# EAGLE schematic brain (EAGLE 7.2.0)
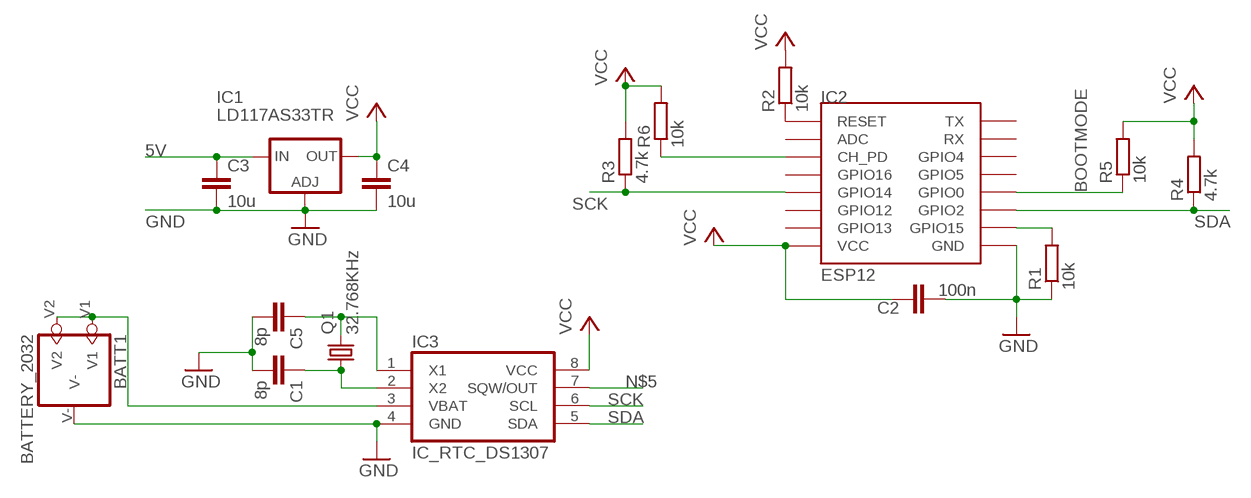
[diagram p0: schematic, sheet 1]

## Parts
BATT1  BATTERY_2032  [BATT2032]
C1  8p  C-EUC0805  [C0805]
C2  100n  C-EUC0805  [C0805]
C3  10u  C-EUC0805  [C0805]
C4  10u  C-EUC0805  [C0805]
C5  8p  C-EUC0805  [C0805]
IC1  LD117AS33TR  [SOT223]
IC2  ESP12  [ESP12]
IC3  IC_RTC_DS1307  [SO-8]
Q1  32.768KHz  CRYSTALTC26H  [TC26H]
R1  10k  R-EU_R0805  [R0805]
R2  10k  R-EU_R0805  [R0805]
R3  4.7k  R-EU_R0805  [R0805]
R4  4.7k  R-EU_R0805  [R0805]
R5  10k  R-EU_R0805  [R0805]
R6  10k  R-EU_R0805  [R0805]

## Nets
5V: C3.1 IC1.3(IN)
BOOTMODE: IC2.GPIO0 R5.1
GND: BATT1.V- C1.2 C2.2 C3.2 C4.2 C5.2 IC1.1(ADJ) IC2.GND IC3.4(GND) R1.1
N$1: IC2.RESET R2.1
N$2: IC2.GPIO15 R1.2
N$4: IC2.CH_PD R6.1
N$5: IC3.7(SQW/OUT)
N$6: C5.1 IC3.1(X1) Q1.2
N$7: BATT1.V1 BATT1.V2 IC3.3(VBAT)
N$8: C1.1 IC3.2(X2) Q1.1
SCK: IC2.GPIO14 IC3.6(SCL) R3.1
SDA: IC2.GPIO2 IC3.5(SDA) R4.1
VCC: C2.1 C4.1 IC1.4(OUT) IC2.VCC IC3.8(VCC) R2.2 R3.2 R4.2 R5.2 R6.2
Unconnected: IC2.ADC IC2.GPIO4 IC2.GPIO5 IC2.GPIO12 IC2.GPIO13 IC2.GPIO16 IC2.RX IC2.TX

## Library data of the parts
BATT1 = dp_devices:BATTERY_2032: BATTERY
C1-C5 = rcl:C-EU: CAPACITOR, European symbol
IC1 = v-reg:LD117A?*: Low drop fixed and adjustable positive voltage regulators 1 A Source: http://www.st.com/stonline/products/literature/ds/7194/ld1117axx.pdf
IC2 = esp8266modules:ESP12: ESP8266 Wifi module 12
IC3 = dp_devices:IC_RTC_DS1307
Q1 = crystal:CRYSTAL: CRYSTAL; OC_FARNELL: unknown; OC_NEWARK: unknown
R1-R6 = rcl:R-EU_: RESISTOR, European symbol